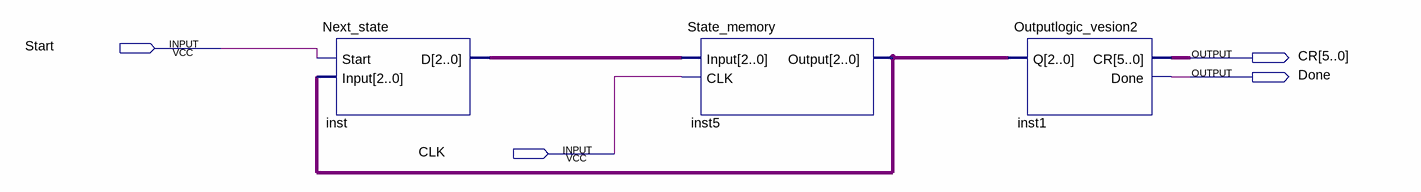
[diagram p0: schematic sheet]
// Quartus schematic Control_version2.bdf as structural Verilog: 3 symbols, 4 pins
module Control_version2 (
  input  Start,
  input  CLK,
  output [5:0] CR,
  output Done
);

  wire [2:0] inst5_output, inst_d;

  Next_state inst (.Start(Start), .Input(inst5_output), .D(inst_d));
  State_memory inst5 (.Input(inst_d), .CLK(CLK), .Output(inst5_output));
  Outputlogic_vesion2 inst1 (.Q(inst5_output), .CR(CR), .Done(Done));
endmodule
